# Altium schematic sheet Relay_IO.SchDoc
size 431 x 279 mm; Organization: ORGANIZATION; Address1: ADDRESS 1; Address2: ADDRESS 2; Address3: ADDRESS 3; Address4: ADDRESS 4; Revision: -; SheetNumber: 3; SheetTotal: 5; ENG_APP_DATE: --/--/--; DSN_APP_DATE: --/--/--; CHK_APP_DATE: --/--/--
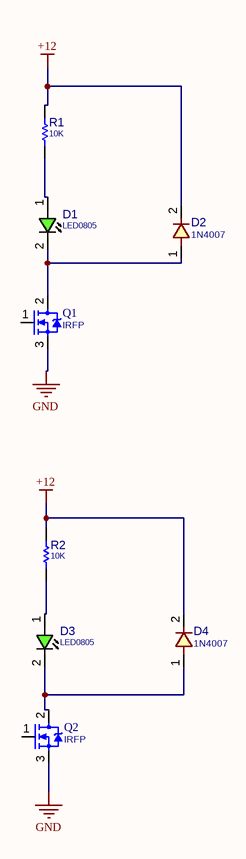
[diagram p0: Relay_IO.SchDoc]

## Parts
D1  LED0805  [LED0805]
D2  1N4007  [D_SMA]
D3  LED0805  [LED0805]
D4  1N4007  [D_SMA]
Q1  IRFP  [TO247_3]
Q2  IRFP  [TO247_3]
R1  10K  [R0805]
R2  10K  [R0805]

## Nets
+12: D2.2 D4.2 R1.2 R2.2
GND: Q1.3(S) Q2.3(S)
NetD1_1: D1.1(ANODE) R1.1
NetD1_2: D1.2(CATHODE) D2.1 Q1.2(D)
NetD3_1: D3.1(ANODE) R2.1
NetD3_2: D3.2(CATHODE) D4.1 Q2.2(D)

Not connected (* = marked no-connect by the designer): Q1 1(G); Q2 1(G)

## Notes on the sheet
- DWG. NO.
- REV.
- SHT.
- THIS DOCUMENT AND THE DATA DISCLOSED HEREIN OR HEREWITH IS THE PROPERTY OF ALTIUM LIMITED AND MAY BE FREELY DISTRIBUTED IN WHOLE. NO RIGHTS ARE RESERVED OR EXPRESS OR IMPLIED WARANTEE GIVEN.
- REVISION
- DESCRIPTION
- DATE
- APPROVED
- ENG:
- APPROVALS
- PROJECT
- DSN:
- CHK:
- REFERENCE DOCUMENTS
- PROJECT REVISION:
- TITLE
- DOCUMENT REVISION:
- DESIGN ITEM:
- BOM:
- FAB DWG:
- PCB DWG:
- ASSY DWG:
- SCALE:
- SIZE
- B
- CAGE CODE
- FILE NAME
- DWG NO.
- SHEET
- OF
- REV

## Library data of the parts
D1 D3 = LED_SMD_0805: LED, SMD, 0805; DESC: DESCRIPTION; MANF_P#: MANF_PART#; PARAM2: 2.2V; MANF: MANF; ASSEMBLY: ASSEMBLY; PRICE: PRICE; VALUE: LED0805
D2 D4 = DIODE_SMD_1N4007: DIODE, GENERAL PURPOSE, 1000V/1A; MANF: Kingtronics; DESC: DESCRIPTION; PARAM: 1000V VRRM; PARAM2: 1A; MANF_P#: M7; ASSEMBLY: ASSEMBLY; PRICE: PRICE; VALUE: 1N4007
Q1 Q2 = MOSN_IRFP: ASSEMBLY: ASSEMBLY; MANF_P#: IRFP; VALUE: IRFP
R1 R2 = RES_SMD_0805: RESISTOR, SMD; PARAM: -W; DESC: DESCRIPTION; DIST#: MOUSER; PARAM2: 1%; MANF_P#: -; MANF: -; ASSEMBLY: ASSEMBLY; PRICE: 100= 0.5$; VALUE: 10K